# EAGLE design dmx_splitter (EAGLE 9.2.2)
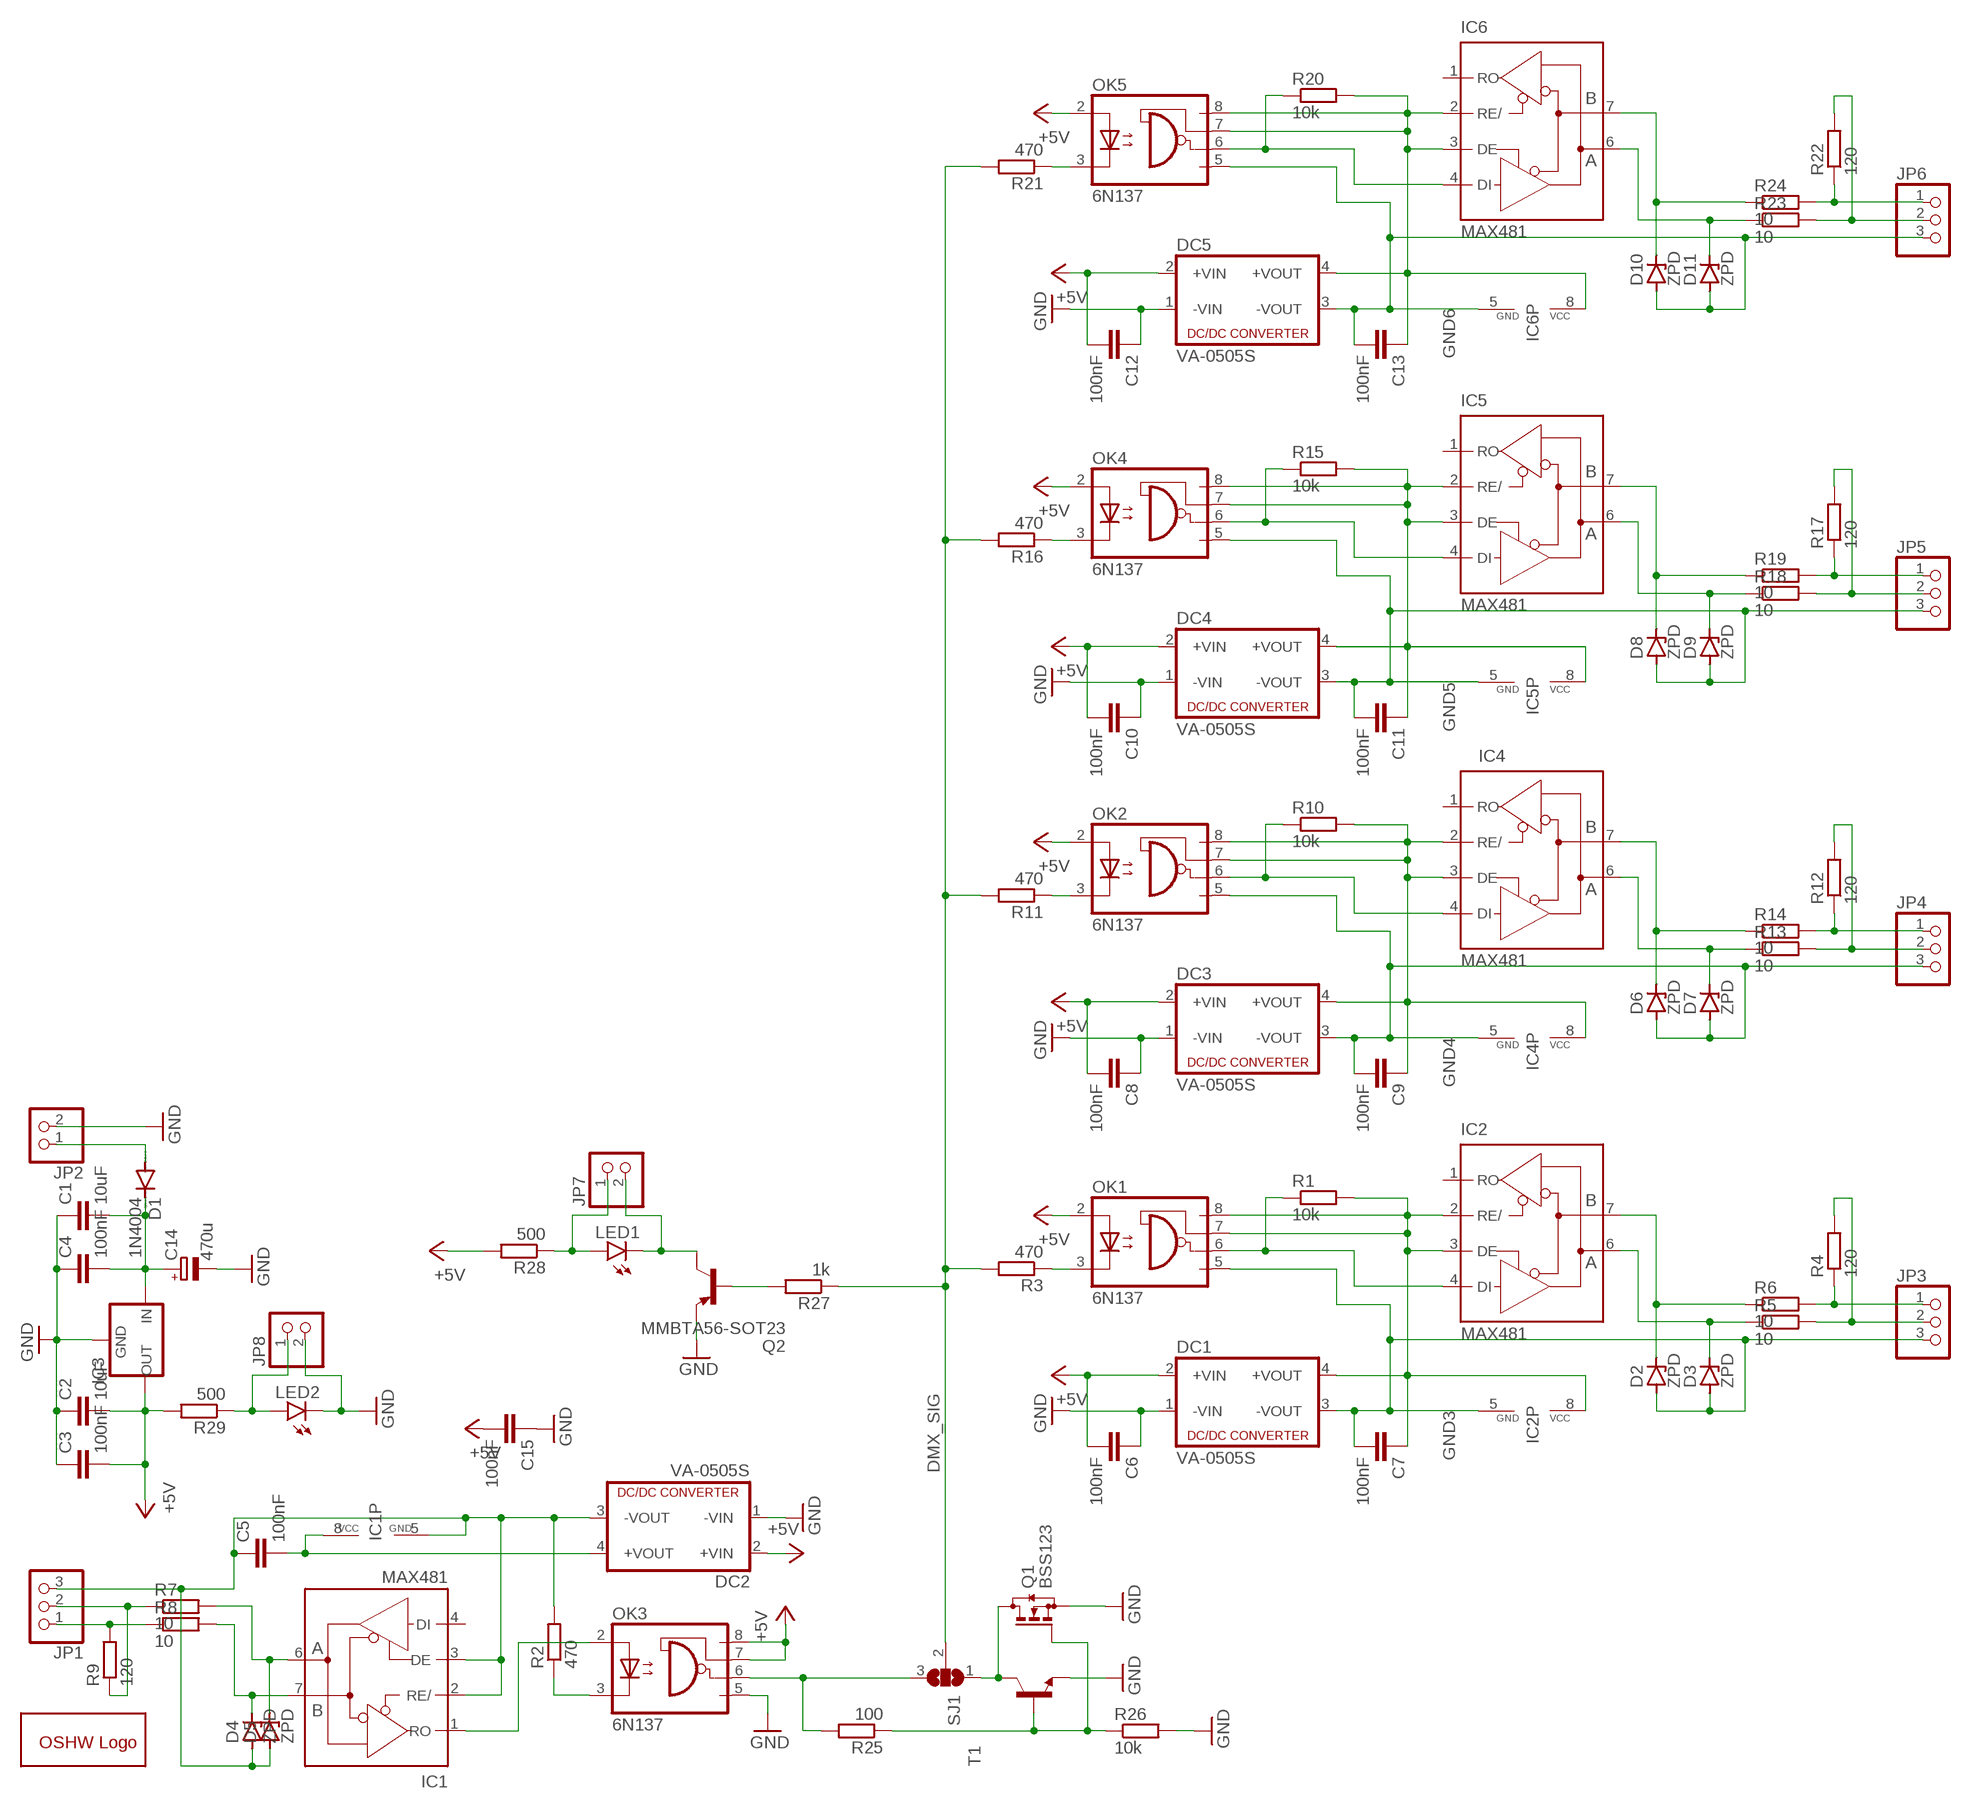
[diagram p0: schematic, sheet 1]

## Parts
C1  10uF  C-EUC1206  [C1206]
C2  10uF  C-EUC1206  [C1206]
C3  100nF  C-EUC1206  [C1206]
C4  100nF  C-EUC1206  [C1206]
C5  100nF  C-EUC1206  [C1206]
C6  100nF  C-EUC1206  [C1206]
C7  100nF  C-EUC1206  [C1206]
C8  100nF  C-EUC1206  [C1206]
C9  100nF  C-EUC1206  [C1206]
C10  100nF  C-EUC1206  [C1206]
C11  100nF  C-EUC1206  [C1206]
C12  100nF  C-EUC1206  [C1206]
C13  100nF  C-EUC1206  [C1206]
C14  470u  CPOL-EUE2.5-7  [E2,5-7]
C15  100nF  C-EUC1206  [C1206]
D1  1N4004  [DO41-10]
D2  ZPD  [DO35Z10]
D3  ZPD  [DO35Z10]
D4  ZPD  [DO35Z10]
D5  ZPD  [DO35Z10]
D6  ZPD  [DO35Z10]
D7  ZPD  [DO35Z10]
D8  ZPD  [DO35Z10]
D9  ZPD  [DO35Z10]
D10  ZPD  [DO35Z10]
D11  ZPD  [DO35Z10]
DC1  VA-0505S  [4SIL]
DC2  VA-0505S  [4SIL]
DC3  VA-0505S  [4SIL]
DC4  VA-0505S  [4SIL]
DC5  VA-0505S  [4SIL]
GOLD_ORB_SM1  OSHWLOGOLOGO5MM  [OSHW_5MM]
IC1  MAX481  MAX481CPA  [DIL08]
IC2  MAX481  MAX481CPA  [DIL08]
IC3  78XXS  [78XXS]
IC4  MAX481  MAX481CPA  [DIL08]
IC5  MAX481  MAX481CPA  [DIL08]
IC6  MAX481  MAX481CPA  [DIL08]
JP1  PINHD-1X3  [1X03]
JP2  PINHD-1X2  [1X02]
JP3  PINHD-1X3  [1X03]
JP4  PINHD-1X3  [1X03]
JP5  PINHD-1X3  [1X03]
JP6  PINHD-1X3  [1X03]
JP7  PINHD-1X2  [1X02]
JP8  PINHD-1X2  [1X02]
LED1  LEDCHIPLED_1206  [CHIPLED_1206]
LED2  LEDCHIPLED_1206  [CHIPLED_1206]
OK1  6N137  [DIL08]
OK2  6N137  [DIL08]
OK3  6N137  [DIL08]
OK4  6N137  [DIL08]
OK5  6N137  [DIL08]
Q1  BSS123  [SOT23]
Q2  MMBTA56-SOT23  [SOT23]
R1  10k  R-EU_R1206  [R1206]
R2  470  R-EU_R1206  [R1206]
R3  470  R-EU_R1206  [R1206]
R4  120  R-EU_R1206  [R1206]
R5  10  R-EU_R1206  [R1206]
R6  10  R-EU_R1206  [R1206]
R7  10  R-EU_R1206  [R1206]
R8  10  R-EU_R1206  [R1206]
R9  120  R-EU_R1206  [R1206]
R10  10k  R-EU_R1206  [R1206]
R11  470  R-EU_R1206  [R1206]
R12  120  R-EU_R1206  [R1206]
R13  10  R-EU_R1206  [R1206]
R14  10  R-EU_R1206  [R1206]
R15  10k  R-EU_R1206  [R1206]
R16  470  R-EU_R1206  [R1206]
R17  120  R-EU_R1206  [R1206]
R18  10  R-EU_R1206  [R1206]
R19  10  R-EU_R1206  [R1206]
R20  10k  R-EU_R1206  [R1206]
R21  470  R-EU_R1206  [R1206]
R22  120  R-EU_R1206  [R1206]
R23  10  R-EU_R1206  [R1206]
R24  10  R-EU_R1206  [R1206]
R25  100  R-EU_R1206  [R1206]
R26  10k  R-EU_R1206  [R1206]
R27  1k  R-EU_R1206  [R1206]
R28  500  R-EU_R1206  [R1206]
R29  500  R-EU_R1206  [R1206]
SJ1  SJ2W  [SJ_2]
T1  -NPN-SOT23-EBC  [SOT23-EBC]

## Nets
+5V: C2.2 C3.2 C6.2 C8.2 C10.2 C12.2 C15.2 DC1.2(+VIN) DC2.2(+VIN) DC3.2(+VIN) DC4.2(+VIN) DC5.2(+VIN) IC3.OUT OK1.2(A) OK2.2(A) OK3.7(VE) OK3.8(VCC) OK4.2(A) OK5.2(A) R28.2 R29.2
DMX_SIG: R3.2 R11.2 R16.2 R21.2 R27.1 SJ1.2
GND: C1.1 C2.1 C3.1 C4.1 C6.1 C8.1 C10.1 C12.1 C14.- C15.1 DC1.1(-VIN) DC2.1(-VIN) DC3.1(-VIN) DC4.1(-VIN) DC5.1(-VIN) IC3.GND JP2.2 JP8.2 LED2.C OK3.5(GND) Q1.2(S) Q2.2(E) R26.2 T1.E
GND2: C5.1 D4.A D5.A DC2.3(-VOUT) IC1.2(RE/) IC1.3(DE) IC1.5(GND) JP1.3 R2.2
GND3: C7.2 D2.A D3.A DC1.3(-VOUT) IC2.5(GND) JP3.3 OK1.5(GND)
GND4: C9.2 D6.A D7.A DC3.3(-VOUT) IC4.5(GND) JP4.3 OK2.5(GND)
GND5: C11.2 D8.A D9.A DC4.3(-VOUT) IC5.5(GND) JP5.3 OK4.5(GND)
GND6: C13.2 D10.A D11.A DC5.3(-VOUT) IC6.5(GND) JP6.3 OK5.5(GND)
N$1: D1.A JP2.1
N$2: C1.2 C4.2 C14.+ D1.C IC3.IN
N$3: OK1.3(C) R3.1
N$4: C5.2 DC2.4(+VOUT) IC1.8(VCC)
N$5: JP1.1 R8.1 R9.2
N$6: JP1.2 R7.1 R9.1
N$9: IC1.1(RO) OK3.2(A)
N$10: OK3.3(C) R2.1
N$12: C7.1 DC1.4(+VOUT) IC2.2(RE/) IC2.3(DE) IC2.8(VCC) OK1.7(VE) OK1.8(VCC) R1.2
N$13: JP3.2 R4.2 R5.2
N$14: JP3.1 R4.1 R6.2
N$15: IC2.4(DI) OK1.6(VO) R1.1
N$16: D3.C IC2.6(A) R5.1
N$17: D2.C IC2.7(B) R6.1
N$18: Q1.3(D) SJ1.1 T1.C
N$19: D4.C IC1.7(B) R8.2
N$20: D5.C IC1.6(A) R7.2
N$21: Q2.1(B) R27.2
N$22: Q1.1(G) R25.1 R26.1 T1.B
N$23: OK3.6(VO) R25.2 SJ1.3
N$24: OK2.3(C) R11.1
N$25: JP7.1 LED1.A R28.1
N$27: C9.1 DC3.4(+VOUT) IC4.2(RE/) IC4.3(DE) IC4.8(VCC) OK2.7(VE) OK2.8(VCC) R10.2
N$28: IC4.4(DI) OK2.6(VO) R10.1
N$29: D7.C IC4.6(A) R13.1
N$30: D6.C IC4.7(B) R14.1
N$31: JP4.2 R12.2 R13.2
N$32: JP4.1 R12.1 R14.2
N$33: OK4.3(C) R16.1
N$34: JP7.2 LED1.C Q2.3(C)
N$36: C11.1 DC4.4(+VOUT) IC5.2(RE/) IC5.3(DE) IC5.8(VCC) OK4.7(VE) OK4.8(VCC) R15.2
N$37: IC5.4(DI) OK4.6(VO) R15.1
N$38: D9.C IC5.6(A) R18.1
N$39: D8.C IC5.7(B) R19.1
N$40: JP5.2 R17.2 R18.2
N$41: JP5.1 R17.1 R19.2
N$42: OK5.3(C) R21.1
N$45: C13.1 DC5.4(+VOUT) IC6.2(RE/) IC6.3(DE) IC6.8(VCC) OK5.7(VE) OK5.8(VCC) R20.2
N$46: IC6.4(DI) OK5.6(VO) R20.1
N$47: D11.C IC6.6(A) R23.1
N$48: D10.C IC6.7(B) R24.1
N$49: JP6.2 R22.2 R23.2
N$50: JP6.1 R22.1 R24.2
N$52: JP8.1 LED2.A R29.1
Unconnected: IC1.4(DI) IC2.1(RO) IC4.1(RO) IC5.1(RO) IC6.1(RO)

## Library data of the parts
C1-C13 C15 = resistor:C-EU: CAPACITOR, European symbol
C14 = resistor:CPOL-EU: POLARIZED CAPACITOR, European symbol
D1 = diode:1N4004: DIODE general purpose rectifier, 1 A
D2-D11 = diode:ZPD: Z DIODE 500 mW
DC1-DC5 = dc-dc-converter:VA-*?: DC DC Converter Single Output, 1 Watt Motien Technology Co.,Ltd. Source: va-serie.pdf
GOLD_ORB_SM1 = oshw:OSHWLOGO: The OSHW logo for PCB layout
IC1 IC2 IC4-IC6 = maxim:MAX481CPA: RS485 TRANSEIVER
IC3 = v-reg:78XXS: VOLTAGE REGULATOR
JP1 JP3-JP6 = pinhead:PINHD-1X3: PIN HEADER
JP2 JP7 JP8 = pinhead:PINHD-1X2: PIN HEADER
LED1 LED2 = led:LED: LED OSRAM: - CHIPLED LG R971, LG N971, LY N971, LG Q971, LY Q971, LO R971, LY R971 LH N974, LH R974 LS Q976, LO Q976, LY Q976 LO Q996 - Hyper CHIPLED LW Q18S LB Q993, LB Q99A, LB R99A - SideLED LS A670, LO A670, LY A670, LG A670, LP A670 LB A673, LV A673, LT A673, LW A673 LH A674 LY A675 LS A676, LA A676, LO A676, LY A676, LW A676 LS A679, LY A679, LG A679 - Hyper Micro SIDELED® LS Y876, LA Y876, LO Y876, LY Y876 LT Y87S - SmartLED LW L88C, LW L88S LB L89C, LB L89S, LG L890 LS L89K, LO L89K, LY L89K LS L896, LA L896, LO L896, LY L896 - TOPLED LS T670, LO T670, LY T670, LG T670, LP T670 LSG T670, LSP T670, LSY T670, LOP T670, LYG T670 LG T671, LOG T671, LSG T671 LB T673, LV T673, LT T673, LW T673 LH T674 LS T676, LA T676, LO T676, LY T676, LB T676, LH T676, LSB T676, LW T676 LB T67C, LV T67C, LT T67C, LS T67K, LO T67K, LY T67K, LW E67C LS E67B, LA E67B, LO E67B, LY E67B, LB E67C, LV E67C, LT E67C LW T67C LS T679, LY T679, LG T679 LS T770, LO T770, LY T770, LG T770, LP T770 LB T773, LV T773, LT T773, LW T773 LH T774 LS E675, LA E675, LY E675, LS T675 LS T776, LA T776, LO T776, LY T776, LB T776 LHGB T686 LT T68C, LB T68C - Hyper Mini TOPLED® LB M676 - Mini TOPLED Santana® LG M470 LS M47K, LO M47K, LY M47K Source: http://www.osram.convergy.de LUXEON: - LUMILED® LXK2-PW12-R00, LXK2-PW12-S00, LXK2-PW14-U00, LXK2-PW14-V00 LXK2-PM12-R00, LXK2-PM12-S00, LXK2-PM14-U00 LXK2-PE12-Q00, LXK2-PE12-R00, LXK2-PE12-S00, LXK2-PE14-T00, LXK2-PE14-U00 LXK2-PB12-K00, LXK2-PB12-L00, LXK2-PB12-M00, LXK2-PB14-N00, LXK2-PB14-P00, LXK2-PB14-Q00 LXK2-PR12-L00, LXK2-PR12-M00, LXK2-PR14-Q00, LXK2-PR14-R00 LXK2-PD12-Q00, LXK2-PD12-R00, LXK2-PD12-S00 LXK2-PH12-R00, LXK2-PH12-S00 LXK2-PL12-P00, LXK2-PL12-Q00, LXK2-PL12-R00 Source: www.luxeon.com KINGBRIGHT: KA-3528ASYC Source: www.kingbright.com
OK1-OK5 = optocoupler:6N137: MOTOROLA OPTO COUPLER; MPN: 6N137; OC_FARNELL: 1328376; OC_NEWARK: 52M1895
Q1 = transistor-small-signal:BSS123: N-CHANNEL MOS FET
Q2 = transistor-pnp:*-?: PNP Transistor
R1-R29 = resistor:R-EU_: RESISTOR, European symbol
SJ1 = jumper:SJ2W: SMD solder JUMPER
T1 = transistor:*-NPN-: NPN Transistror BF959 corrected 2008.03.06

## Board
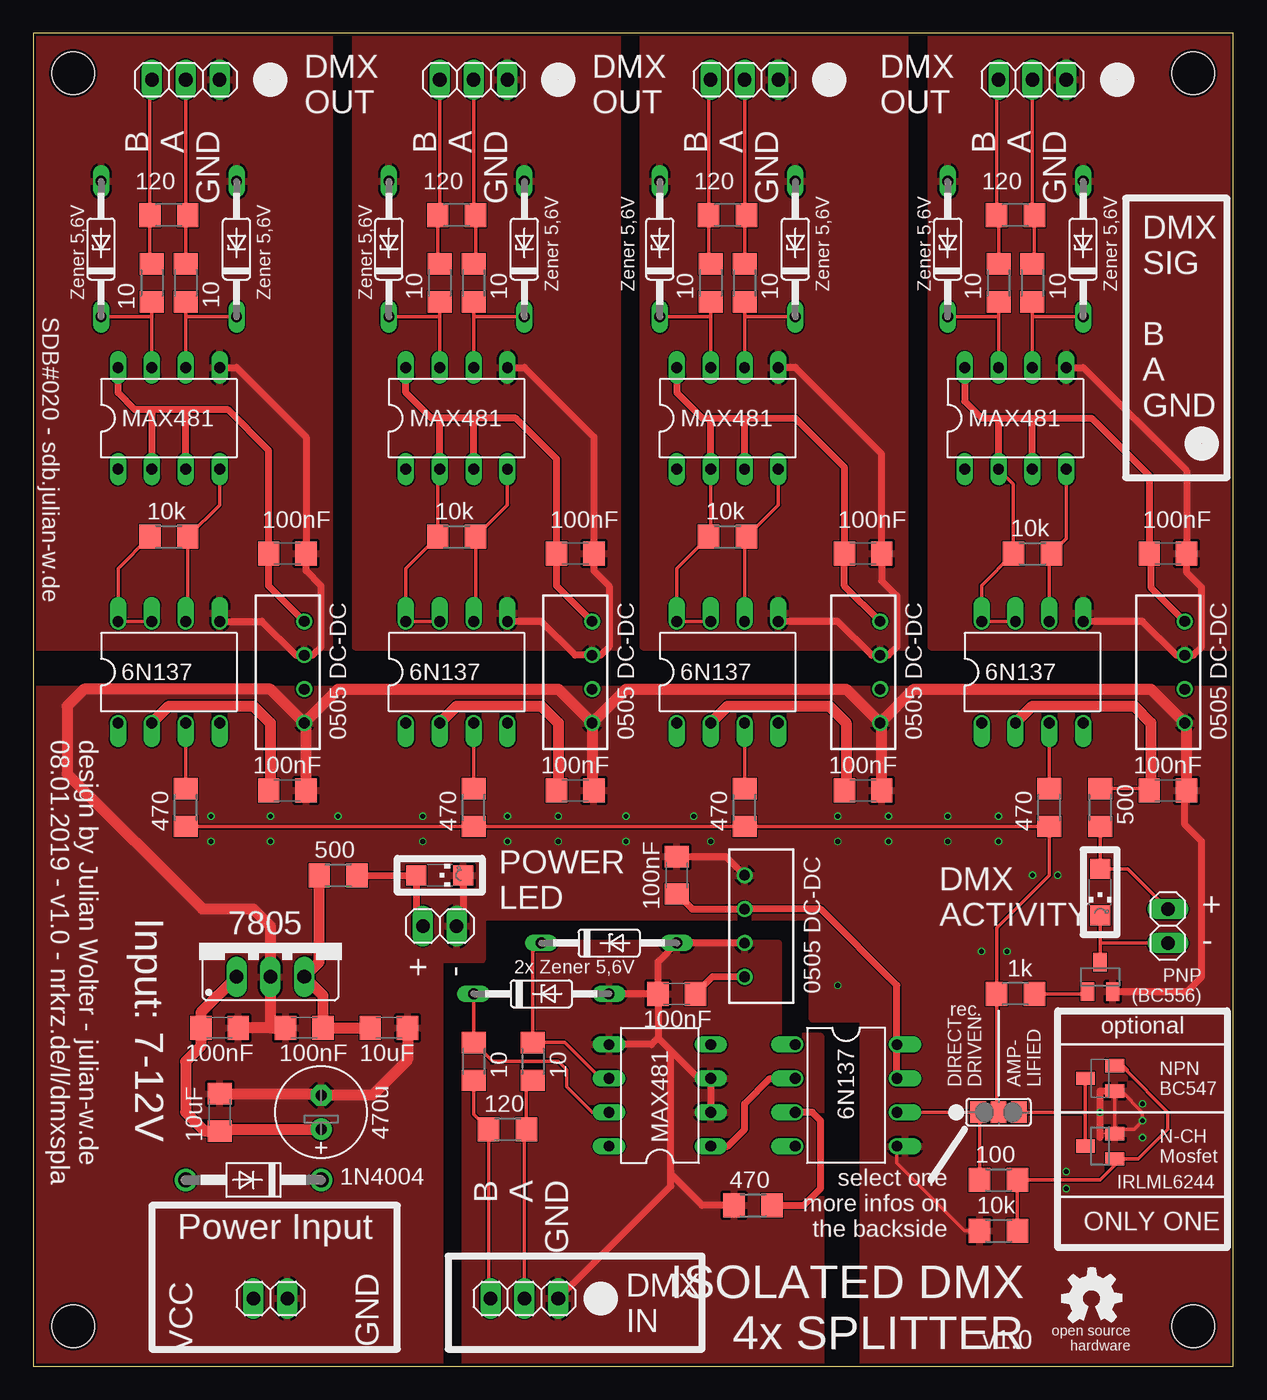
[diagram p1: board, top side]
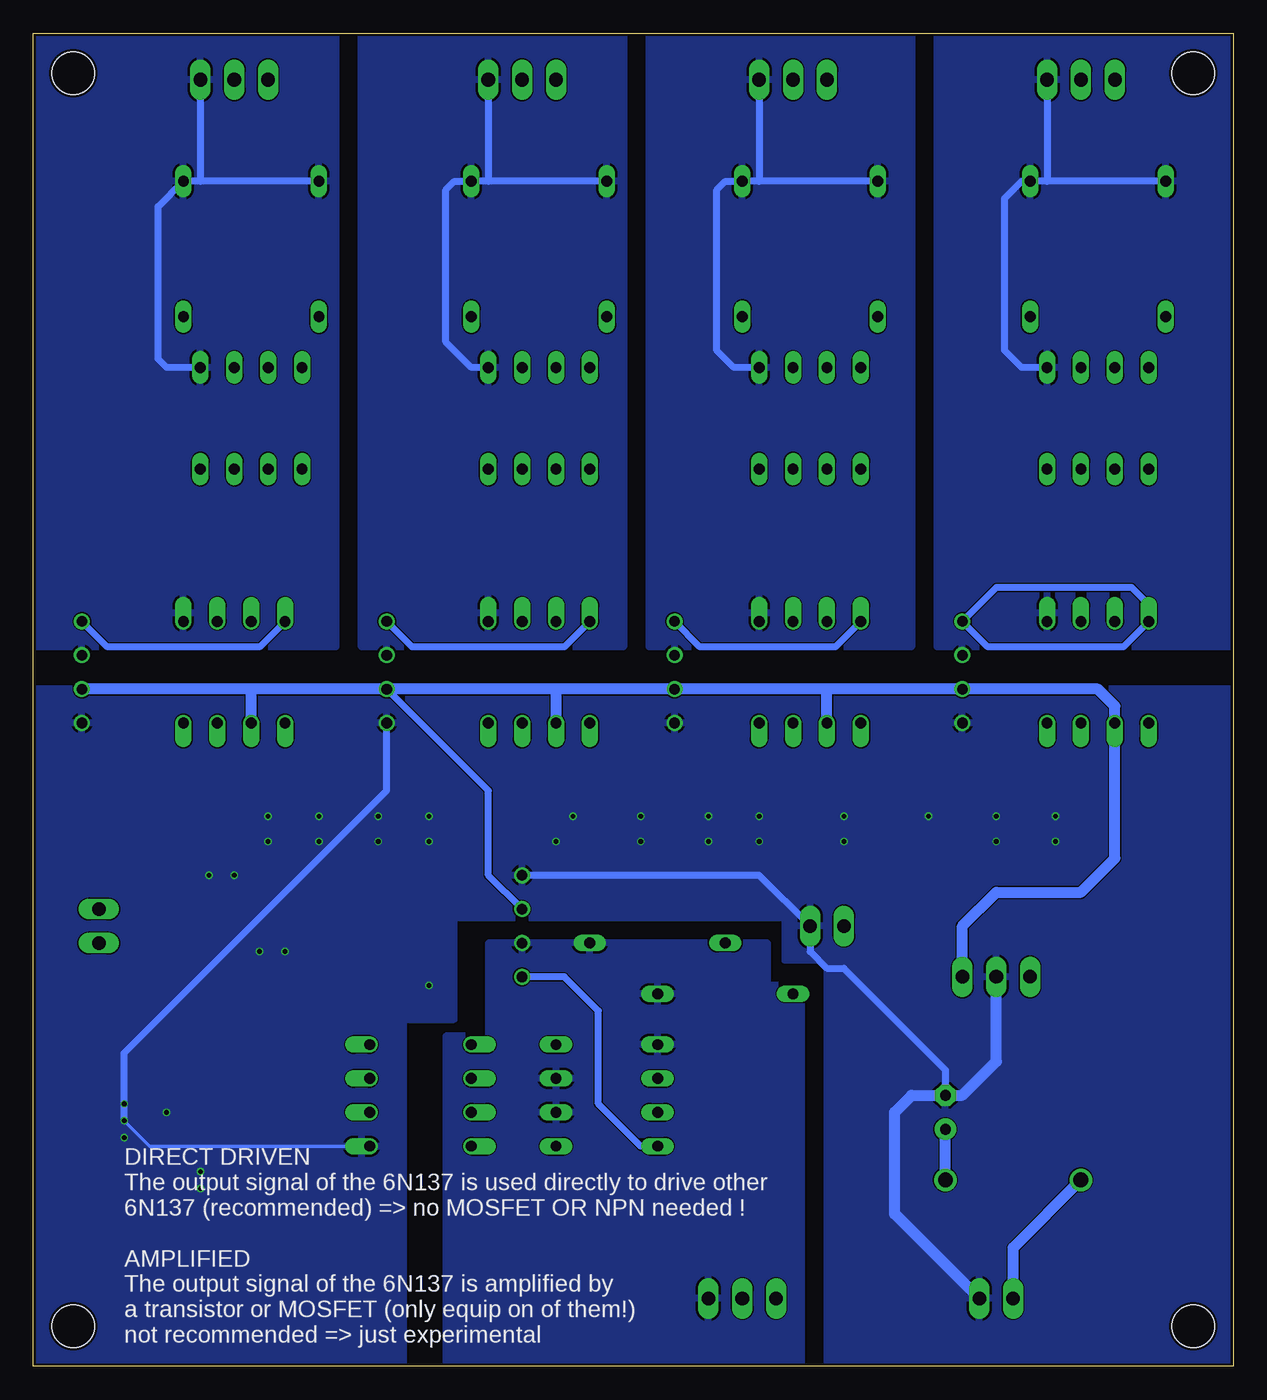
[diagram p2: board, bottom side, seen from below]

Size 90 x 100 mm. Coordinates in mm from the lower left corner, seen from the top.
Outline: 0,0 90,0 90,100 0,100 0,0
Copper layers (1*16): Top 0.018mm / dielectric 1.55mm / Bottom 0.018mm
Design rules "Multi-CB_2L_100µm-Tracks_OL35µm": minimum track width 0.1mm, minimum drill 0.2mm, track to track 0.1mm, track to pad 0.1mm, pad to pad 0.1mm, via to via 0.1mm, smd to smd 0mil, copper to edge 0.2mm, drill to drill 0.2mm, minimum pad ring 0.125mm, minimum via ring 0.1mm, stop-mask expansion 2mil, vias tented up to drill 0.45mm, thermal gap 0.2mm
Holes 3.2 mm at 3,3 87,3 87,97 3,97

### Footprints (pad centres in the part's own frame; a part is rotated, then mirrored left to right if it is on the bottom)
C1206 = smd 1.6 x 1.8: 1 -1.4,0; 2 1.4,0
E2,5-7 = drill 0.813 pad 1.6: + -1.27,0 | drill 0.813 pad 1.6 octagon: - 1.27,0
DO41-10 = drill 1.118: A 5.08,0; C -5.08,0
DO35Z10 = drill 0.813 long: A 5.08,0; C -5.08,0
4SIL = drill 0.8: 1 -3.81,0; 2 -1.27,0; 3 1.27,0; 4 3.81,0
DIL08 = drill 0.813 long: 1 -3.81,-3.81; 2 -1.27,-3.81; 3 1.27,-3.81; 4 3.81,-3.81; 5 3.81,3.81; 6 1.27,3.81; 7 -1.27,3.81; 8 -3.81,3.81
78XXS = drill 1.016 long: GND 0,-2.54; IN -2.54,-2.54; OUT 2.54,-2.54
1X03 = drill 1.016 long: 1 -2.54,0; 2 0,0; 3 2.54,0
1X02 = drill 1.016 long: 1 -1.27,0; 2 1.27,0
CHIPLED_1206 = smd 1.5 x 1.5: A 0,-1.75; C 0,1.75
DIL08' = drill 0.813 offset: 1 -3.81,-3.81; 2 -1.27,-3.81; 3 1.27,-3.81; 4 3.81,-3.81; 5 3.81,3.81; 6 1.27,3.81; 7 -1.27,3.81; 8 -3.81,3.81
SOT23 = smd 1 x 1.4: 1 -0.95,-1.1; 2 0.95,-1.1; 3 0,1.1
R1206 = smd 1.6 x 1.803: 1 -1.422,0; 2 1.422,0
SJ_2 = smd 1.168 x 1.6: 1 -1.524,0; 2 0,0; 3 1.524,0
SOT23-EBC = smd 1 x 1.4: B 0.95,-1.1; C 0,1.1; E -0.95,-1.1

### Placement (x,y rotation side)
C1  13.97,19.05 270 top
C2  26.67,25.4 180 top
C3  20.32,25.4 0 top
C4  13.97,25.4 180 top
C5  48.26,27.94 0 top
C6  85.09,43.18 180 top
C7  85.09,60.96 0 top
C8  62.23,43.18 180 top
C9  62.23,60.96 0 top
C10  19.05,43.18 180 top
C11  40.64,60.96 0 top
C12  40.64,43.18 180 top
C13  19.05,60.96 0 top
C14  21.59,19.05 90 top
C15  48.26,36.83 270 top
D1  16.51,13.97 180 top
D2  68.58,83.82 90 top
D3  78.74,83.82 90 top
D4  38.1,27.94 0 top
D5  43.18,31.75 0 top
D6  46.99,83.82 90 top
D7  57.15,83.82 90 top
D8  26.67,83.82 90 top
D9  36.83,83.82 90 top
D10  5.08,83.82 90 top
D11  15.24,83.82 90 top
DC1  86.36,52.07 90 top
DC2  53.34,33.02 270 top
DC3  63.5,52.07 90 top
DC4  41.91,52.07 90 top
DC5  20.32,52.07 90 top
GOLD_ORB_SM1  79.38,5.08 0 top
IC1  46.99,20.32 90 top
IC2  73.66,71.12 0 top
IC3  17.78,31.75 0 top
IC4  52.07,71.12 0 top
IC5  31.75,71.12 0 top
IC6  10.16,71.12 0 top
JP1  36.83,5.08 0 top
JP2  17.78,5.08 0 top
JP3  74.93,96.52 0 top
JP4  53.34,96.52 0 top
JP5  33.02,96.52 0 top
JP6  11.43,96.52 0 top
JP7  85.09,33.02 270 top
JP8  30.48,33.02 0 top
LED1  80.01,35.56 180 top
LED2  30.48,36.83 270 top
OK1  6N137  [DIL08']  74.93,52.07 0 top
OK2  6N137  [DIL08']  52.07,52.07 0 top
OK3  6N137  [DIL08']  60.96,20.32 270 top
OK4  6N137  [DIL08']  31.75,52.07 0 top
OK5  6N137  [DIL08']  10.16,52.07 0 top
Q1  80.01,16.51 90 top
Q2  80.01,29.21 0 top
R1  74.93,60.96 180 top
R2  53.98,12.06 180 top
R3  76.2,41.91 270 top
R4  73.66,86.36 0 top
R5  74.93,81.28 90 top
R6  72.39,81.28 90 top
R7  37.47,22.86 90 top
R8  33.02,22.86 90 top
R9  35.56,17.78 180 top
R10  52.07,62.23 180 top
R11  53.34,41.91 270 top
R12  52.07,86.36 0 top
R13  53.34,81.28 90 top
R14  50.8,81.28 90 top
R15  31.75,62.23 180 top
R16  33.02,41.91 270 top
R17  31.75,86.36 0 top
R18  33.02,81.28 90 top
R19  30.48,81.28 90 top
R20  10.16,62.23 180 top
R21  11.43,41.91 270 top
R22  10.16,86.36 0 top
R23  11.43,81.28 90 top
R24  8.89,81.28 90 top
R25  72.39,13.97 180 top
R26  72.39,10.16 180 top
R27  73.66,27.94 0 top
R28  80.01,41.91 90 top
R29  22.86,36.83 180 top
SJ1  72.39,19.05 180 top
T1  80.01,21.59 90 top

### Tracks (layer width: path | path; a pad name or v marks a point on that pad's centre or on a via)
+5V
  Top 0.254: R28.2 83.67,43.33 83.82,43.18
  Top 0.508: C15.2 49.4,34.29 DC2.2 59.05,34.29 64.77,28.57 OK3.8 OK3.7
  Top 0.813: C2.2 C3.2 21.72,27.81 IC3.OUT 21.44,30.33 R29.2 | OK1.2 74.93,49.53 82.55,49.53 83.82,48.26 83.82,43.18 C6.2 | OK2.2 52.07,49.53 59.69,49.53 60.96,48.26 60.96,43.18 C8.2 | OK4.2 31.75,49.53 38.1,49.53 39.37,48.26 39.37,43.31 C12.2 | OK5.2 10.16,49.53 16.51,49.53 17.78,48.26 17.78,43.18 C10.2
  Bottom 0.508: DC2.2 55.88,36.83 55.88,43.18 DC3.2
  Bottom 0.813: IC3.OUT 20.32,33.02 17.78,35.56 11.43,35.56 8.89,38.1 OK5.2 8.89,49.53 10.16,50.8 DC5.2 30.48,50.8 | 30.48,50.8 DC4.2 50.8,50.8 | 50.8,50.8 DC3.2 73.66,50.8 | 73.66,50.8 DC1.2 | OK4.2 30.48,50.8 | OK2.2 50.8,50.8 | OK1.2 73.66,50.8
DMX_SIG
  Top 0.254: R21.2 R16.2 R11.2 R3.2 76.2,36.83 72.24,32.87 R27.1 72.24,19.2 SJ1.2
GND  (via drill 0.35)
  Top 0.127: Q1.2 80.01,17.46 80.01,17.14
  Top 0.254: OK3.5 64.77,15.24 69.85,10.16 R26.2 | Q1.2 81.11,17.78 | 81.11,17.78 T1.E 81.59,20.64 83.19,19.05 v83.19,18.41 82.55,17.78 81.11,17.78
  Top 0.508: C15.1 51.94,38.23 DC2.1 | LED2.C 32.23,33.5 JP8.2 | Q2.2 86.53,28.11 87.63,29.21 87.63,39.37 86.36,40.64 86.36,43.05 C6.1 | 80.01,17.14 v80.01,19.05 80.01,20.64 T1.E
  Top 0.813: C1.1 21.46,20.45 C14.- 25.4,20.32 28.07,22.99 C2.1 | 17.78,25.4 C3.1 | 17.78,25.4 IC3.GND 17.78,33.02 16.51,34.29 12.7,34.29 2.54,44.45 2.54,49.53 3.81,50.8 17.78,50.8 DC5.1 | 17.78,25.4 C4.1 | DC5.1 22.86,50.8 39.37,50.8 DC4.1 | DC4.1 44.45,50.8 60.96,50.8 DC3.1 | DC3.1 66.04,50.8 83.82,50.8 DC1.1 86.49,48.13 C6.1 | C8.1 63.63,48.13 DC3.1 | C10.1 20.45,48.13 DC5.1 | DC4.1 41.91,43.31 C12.1
  Bottom 0.254: v83.19,18.41 81.28,16.51 OK3.5
  Bottom 0.508: C14.- 21.59,22.23 29.21,29.84 30.48,29.84 31.75,31.11 JP8.2 35.56,36.83 DC2.1 | v83.19,18.41 83.19,23.5 63.5,43.18 DC3.1
  Bottom 0.813: JP2.2 25.4,11.43 25.4,19.05 24.13,20.32 C14.- 20.32,20.32 17.78,22.86 IC3.GND
  other vias: 83.19,17.14 83.19,19.68 64.14,39.37 64.14,41.27 60.33,39.37 60.33,41.27 68.58,41.27 68.58,39.37 72.39,39.37 72.39,41.27 50.8,39.37 44.45,39.37 44.45,41.27 49.53,41.27 39.37,41.27 39.37,39.37 35.56,39.37 35.56,41.27 29.21,39.37 29.21,41.27 22.86,41.27 17.78,41.27 17.78,39.37 13.34,39.37 13.34,41.27 71.12,31.11 73.03,31.11 76.83,36.83 74.93,36.83 77.47,13.34 77.47,14.61 60.33,28.57
  pour Bottom: -7.62,50.8 93.34,50.8 93.98,50.16 93.98,-3.17 94.61,-3.81 62.23,-3.81 62.23,26.04 58.42,26.04 58.42,33.66 33.66,33.66 33.66,30.48 30.48,30.48 30.48,-6.99 -7.62,-6.99
  pour Top: -7.62,50.8 93.34,50.8 93.98,50.16 93.98,-3.17 94.61,-3.81 62.23,-3.81 62.23,26.04 58.42,26.04 58.42,33.66 33.66,33.66 33.66,30.48 30.48,30.48 30.48,-6.99 -7.62,-6.99
GND2
  Top 0.508: DC2.3 D5.A 46.86,30.35 C5.1 | C5.1 D4.A | C5.1 46.86,24.64 | 46.86,24.64 46.35,24.13 IC1.5 | 47.81,23.68 49.91,21.59 IC1.3 IC1.2 | 47.81,23.68 46.86,24.64 | R2.2 50.16,12.06 47.81,14.42 | 47.81,14.42 47.81,14.61 47.81,23.68 | JP1.3 47.81,13.52 47.81,14.42
  pour Top: 32.38,-0.64 32.38,28.57 33.66,28.57 34.29,28.57 34.92,28.57 34.92,31.75 54.61,31.75 55.88,31.75 55.88,26.04 55.88,24.77 59.05,24.77 59.05,12.06 59.05,-0.64
  pour Bottom: 32.38,-0.64 32.38,28.57 33.66,28.57 34.29,28.57 34.92,28.57 34.92,31.75 54.61,31.75 55.88,31.75 55.88,26.04 55.88,24.77 59.05,24.77 59.05,12.06 59.05,-0.64
GND3
  Top 0.508: OK1.5 83.19,55.88 85.72,53.34 DC1.3 87,53.34 87.63,53.98 87.63,58.42 86.49,59.56 C7.2 86.49,67.18 78.74,74.93 IC2.5
  Bottom 0.508: D2.A 77.47,88.9 | 77.47,88.9 D3.A 80.64,87 80.64,75.56 80.01,74.93 IC2.5 | JP3.3 77.47,88.9
  pour Top: 67.31,100.97 67.31,53.98 98.42,53.98 98.42,100.97
  pour Bottom: 67.31,100.97 67.31,53.98 98.42,53.98 98.42,100.97
GND4
  Top 0.508: OK2.5 60.33,55.88 62.87,53.34 DC3.3 64.14,53.34 64.77,53.98 64.77,57.78 63.63,58.92 C9.2 63.63,68.45 57.15,74.93 IC4.5
  Bottom 0.508: D6.A 55.88,88.9 | 55.88,88.9 D7.A 58.42,88.9 59.05,88.27 59.05,76.83 57.15,74.93 IC4.5 | JP4.3 55.88,88.9
  pour Top: 46.99,53.98 65.41,53.98 65.41,57.78 65.41,101.6 45.72,101.6 45.72,53.98
  pour Bottom: 46.99,53.98 65.41,53.98 65.41,57.78 65.41,101.6 45.72,101.6 45.72,53.98
GND5
  Top 0.508: OK4.5 38.1,55.88 40.64,53.34 DC4.3 42.55,53.34 43.18,53.98 43.18,58.55 42.04,59.69 C11.2 42.04,69.72 36.83,74.93 IC5.5
  Bottom 0.508: D8.A 35.56,88.9 | 35.56,88.9 D9.A 38.1,88.9 38.73,88.27 38.73,76.2 37.47,74.93 IC5.5 | JP5.3 35.56,88.9
  pour Top: 24.13,100.97 24.13,53.98 43.81,53.98 43.81,100.97
  pour Bottom: 24.13,100.97 24.13,53.98 43.81,53.98 43.81,100.97
GND6
  Top 0.508: OK5.5 17.14,55.88 19.68,53.34 DC5.3 20.95,53.34 21.59,53.98 21.59,58.55 20.45,59.69 C13.2 20.45,69.72 15.24,74.93 IC6.5
  Bottom 0.508: D10.A 13.97,88.9 | 13.97,88.9 D11.A 15.88,88.9 17.14,87.63 17.14,76.2 15.88,74.93 IC6.5 | JP6.3 13.97,88.9
  pour Top: -1.27,53.98 22.23,53.98 22.23,101.6 -2.54,101.6 -2.54,53.98
  pour Bottom: -1.27,53.98 22.23,53.98 22.23,101.6 -2.54,101.6 -2.54,53.98
N$1
  Bottom 0.813: JP2.1 16.51,8.89 D1.A
N$2
  Top 0.813: C14.+ 14.1,17.78 C1.2 12.83,17.65 11.43,19.05 11.43,22.86 12.57,24 C4.2 12.57,26.54 IC3.IN
  Bottom 0.813: D1.C C14.+
N$3
  Top 0.254: R3.1 OK1.3
N$4
  Top 0.508: DC2.4 50.93,29.21 C5.2
  Bottom 0.508: IC1.8 44.45,16.51 47.62,19.68 47.62,26.67 50.16,29.21 DC2.4
N$5
  Top 0.254: JP1.1 34.14,5.23 R9.2 33.02,18.9 R8.1
N$6
  Top 0.254: JP1.2 36.83,17.63 R9.1 36.98,20.95 R7.1
N$9
  Top 0.508: IC1.1 52.07,16.51 53.34,17.78 53.34,19.68 55.24,21.59 OK3.2
N$10
  Top 0.508: R2.1 57.78,12.06 59.05,13.34 59.05,18.41 58.42,19.05 OK3.3
N$12
  Top 0.254: IC2.2 73.51,66.19 R1.2 71.12,58.57 OK1.8 OK1.7
  Top 0.508: DC1.4 83.82,58.42 83.82,60.83 C7.1 83.69,66.81 79.38,71.12 74.93,71.12 | IC2.8 69.85,72.39 71.12,71.12 72.39,71.12 | 72.39,71.12 74.93,71.12 | IC2.2 72.39,71.12 | IC2.3 74.93,71.12
  Bottom 0.508: OK1.8 73.03,53.98 84.45,53.98 DC1.4
N$13
  Top 0.254: JP3.2 74.93,86.51 R4.2 75.08,82.85 R5.2
N$14
  Top 0.254: JP3.1 72.24,96.37 R4.1 72.39,86.21 R6.2
N$15
  Top 0.254: IC2.4 77.47,62.08 R1.1 76.2,60.81 OK1.6
N$16
  Top 0.254: R5.1 74.93,78.74 | 74.93,78.74 IC2.6 | D3.C 74.93,78.74
N$17
  Top 0.254: IC2.7 72.39,78.74 | 72.39,78.74 R6.1 | D2.C 72.39,78.74
N$18
  Top 0.254: Q1.3 78.91,19.05 | 78.91,19.05 T1.C | SJ1.1 78.91,19.05
N$19
  Top 0.254: D4.C R8.2 34.44,22.86 39.37,22.86 40.01,22.23 40.01,20.95 41.91,19.05 IC1.7
N$20
  Top 0.254: D5.C 37.47,31.11 R7.2 39.85,24.28 42.55,21.59 IC1.6
N$21
  Top 0.254: R27.2 78.89,27.94 Q2.1
N$22
  Top 0.254: R26.1 R25.1 80.01,13.97 81.28,15.24 81.11,15.41 Q1.1 82.87,15.56 85.09,17.78 85.09,19.05 81.92,22.23 82.06,22.23 81.75,22.54 T1.B
N$23
  Top 0.254: R25.2 70.97,18.95 SJ1.3 OK3.6
N$24
  Top 0.254: R11.1 OK2.3
N$25
  Top 0.254: JP7.1 82.07,37.31 LED1.A R28.1
N$27
  Top 0.254: OK2.7 OK2.8 48.26,59.84 R10.2 50.8,62.38 IC4.2
  Top 0.508: DC3.4 60.83,58.55 C9.1 60.83,67.44 57.15,71.12 53.34,71.12 | IC4.8 48.26,73.03 50.16,71.12 50.8,71.12 | 50.8,71.12 53.34,71.12 | IC4.3 53.34,71.12 | IC4.2 50.8,71.12
  Bottom 0.508: OK2.8 50.16,53.98 61.59,53.98 DC3.4
N$28
  Top 0.254: OK2.6 53.34,62.08 R10.1 55.88,64.62 IC4.4
N$29
  Top 0.254: IC4.6 53.34,78.74 | 53.34,78.74 R13.1 | D7.C 53.34,78.74
N$30
  Top 0.254: R14.1 50.8,78.74 | 50.8,78.74 IC4.7 | D6.C 50.8,78.74
N$31
  Top 0.254: R12.2 53.42,86.28 | 53.42,86.28 53.34,86.21 R13.2 | JP4.2 53.34,86.36 53.42,86.28
N$32
  Top 0.254: R14.2 50.65,82.85 R12.1 50.65,96.37 JP4.1
N$33
  Top 0.254: R16.1 OK4.3
N$34
  Top 0.254: Q2.3 80.01,31.75 | 80.01,31.75 LED1.C | JP7.2 80.01,31.75
N$36
  Top 0.254: IC5.2 30.33,67.16 R15.2 27.94,59.84 OK4.8 OK4.7
  Top 0.508: DC4.4 39.24,58.55 C11.1 39.24,68.08 36.2,71.12 33.02,71.12 | IC5.8 27.94,73.03 29.84,71.12 30.48,71.12 | 33.02,71.12 30.48,71.12 | IC5.2 30.48,71.12 | IC5.3 33.02,71.12
  Bottom 0.508: DC4.4 40.01,53.98 29.84,53.98 OK4.8
N$37
  Top 0.254: IC5.4 35.56,64.62 R15.1 33.17,56.03 OK4.6
N$38
  Top 0.254: R18.1 33.02,78.74 | 33.02,78.74 IC5.6 | D9.C 33.02,78.74
N$39
  Top 0.254: R19.1 30.48,78.74 | 30.48,78.74 IC5.7 | D8.C 30.48,78.74
N$40
  Top 0.254: JP5.2 33.02,86.51 R17.2 33.17,82.85 R18.2
N$41
  Top 0.254: JP5.1 30.48,86.51 R17.1 30.33,82.85 R19.2
N$42
  Top 0.254: R21.1 OK5.3
N$45
  Top 0.254: R20.2 6.35,59.84 OK5.8 OK5.7
  Top 0.508: DC5.4 17.65,58.55 C13.1 17.65,68.71 14.61,71.75 11.43,71.75 | IC6.8 6.35,73.03 7.62,71.75 8.89,71.75 | 11.43,71.75 8.89,71.75 | 8.89,71.75 IC6.2 | IC6.3 11.43,71.75
  Bottom 0.508: OK5.8 6.35,57.15 7.62,58.42 17.78,58.42 DC5.4 18.41,53.98 8.26,53.98 OK5.8
N$46
  Top 0.254: OK5.6 11.58,56.03 R20.1 13.97,64.62 IC6.4
N$47
  Top 0.254: IC6.6 11.43,78.74 | 11.43,78.74 R23.1 | D11.C 11.43,78.74
N$48
  Top 0.254: IC6.7 8.89,78.74 | 8.89,78.74 R24.1 | D10.C 8.89,78.74
N$49
  Top 0.254: R22.2 11.43,86.21 | 11.43,86.21 R23.2 | JP6.2 11.43,86.21
N$50
  Top 0.254: R24.2 8.74,82.85 R22.1 8.74,96.37 JP6.1
N$52
  Top 0.508: R29.1 LED2.A 28.73,33.5 JP8.1

### Text on the board
tPlace: DMX / OUT | DMX / OUT | DMX / OUT | B / A / GND | B / A / GND | B / A / GND | B / A / GND | DMX / SIG / / B / A / GND | Zener 5,6V | Zener 5,6V | Zener 5,6V | Zener 5,6V | Zener 5,6V | Zener 5,6V | Zener 5,6V | Zener 5,6V | SDB#020 - sdb.julian-w.de | design by Julian Wolter - julian-w.de / 08.01.2019 - v1.0 - nrkrz.de/l/dmxspla | 0505 DC-DC | 0505 DC-DC | 0505 DC-DC | 0505 DC-DC | Input: 7-12V | POWER / LED | DMX / ACTIVITY | 7805 | + / - | 2x Zener 5,6V | PNP / (BC556) | + / - | 0505 DC-DC | rec. | optional | DIRECT / DRIVEN | AMP- / LIFIED | NPN / BC547 | select one / more infos on / the backside | N-CH / Mosfet | B / A / GND | IRLML6244 | Power Input | ONLY ONE | ISOLATED DMX / 4x SPLITTER | GND | VCC | DMX / IN | v1.0
bPlace: DIRECT DRIVEN / The output signal of the 6N137 is used directly to drive other / 6N137 (recommended) => no MOSFET OR NPN needed ! / / AMPLIFIED / The output signal of the 6N137 is amplified by / a transistor or MOSFET (only equip on of them!) / not recommended => just experimental